# Altium schematic sheet Transmisor2.SchDoc
size A3
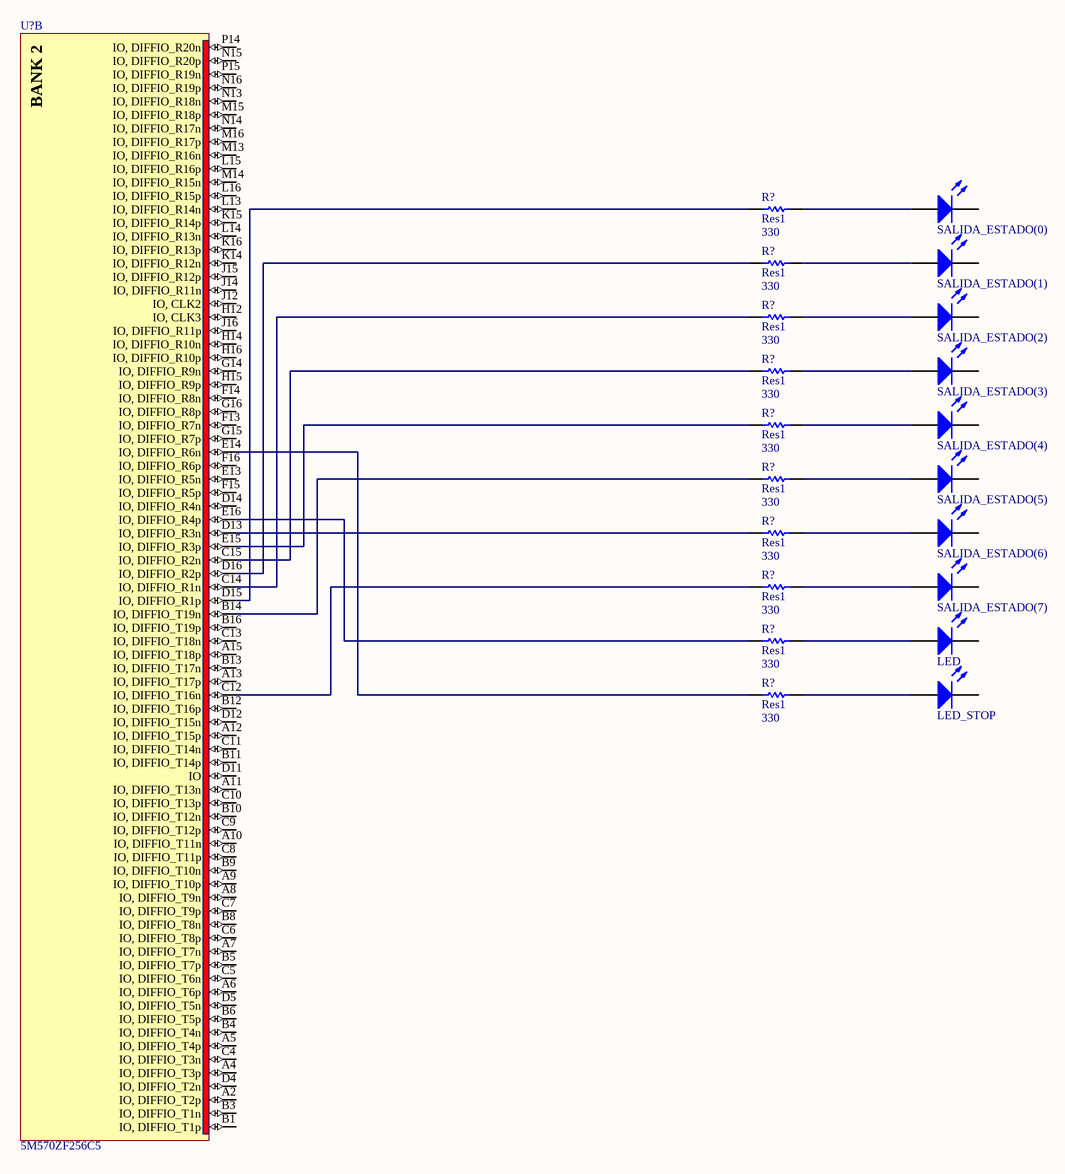
[diagram p0: Transmisor2.SchDoc]

## Parts
(Parts that share a designator on the sheet are numbered #1, #2 ... from top to bottom, then left to right.)
?#1  SALIDA_ESTADO(0)  [LED-0]
?#2  SALIDA_ESTADO(1)  [LED-0]
?#3  SALIDA_ESTADO(2)  [LED-0]
?#4  SALIDA_ESTADO(3)  [LED-0]
?#5  SALIDA_ESTADO(4)  [LED-0]
?#6  SALIDA_ESTADO(5)  [LED-0]
?#7  SALIDA_ESTADO(6)  [LED-0]
?#8  SALIDA_ESTADO(7)  [LED-0]
?#9  LED  [LED-0]
?#10  LED_STOP  [LED-0]
R?#1  Res1  value 330  [AXIAL-0.3]
R?#2  Res1  value 330  [AXIAL-0.3]
R?#3  Res1  value 330  [AXIAL-0.3]
R?#4  Res1  value 330  [AXIAL-0.3]
R?#5  Res1  value 330  [AXIAL-0.3]
R?#6  Res1  value 330  [AXIAL-0.3]
R?#7  Res1  value 330  [AXIAL-0.3]
R?#8  Res1  value 330  [AXIAL-0.3]
R?#9  Res1  value 330  [AXIAL-0.3]
R?#10  Res1  value 330  [AXIAL-0.3]
U?  5M570ZF256C5  [FBGA256_A-155]  (part B of 5)

## Nets
Net?#1_1: ?#1.1(A) R?#1.2
Net?#2_1: ?#2.1(A) R?#2.2
Net?#3_1: ?#3.1(A) R?#3.2
Net?#4_1: ?#4.1(A) R?#4.2
Net?#5_1: ?#5.1(A) R?#5.2
Net?#6_1: ?#6.1(A) R?#6.2
Net?#7_1: ?#7.1(A) R?#7.2
Net?#8_1: ?#8.1(A) R?#8.2
Net?#9_1: ?#9.1(A) R?#9.2
Net?#10_1: ?#10.1(A) R?#10.2
NetR?#1_1: R?#1.1 U?.D15(IO,_DIFFIO_R1p)
NetR?#2_1: R?#2.1 U?.D16(IO,_DIFFIO_R2p)
NetR?#3_1: R?#3.1 U?.C14(IO,_DIFFIO_R1n)
NetR?#4_1: R?#4.1 U?.C15(IO,_DIFFIO_R2n)
NetR?#5_1: R?#5.1 U?.E15(IO,_DIFFIO_R3p)
NetR?#6_1: R?#6.1 U?.B14(IO,_DIFFIO_T19n)
NetR?#7_1: R?#7.1 U?.D13(IO,_DIFFIO_R3n)
NetR?#8_1: R?#8.1 U?.C12(IO,_DIFFIO_T16n)
NetR?#9_1: R?#9.1 U?.E16(IO,_DIFFIO_R4p)
NetR?#10_1: R?#10.1 U?.E14(IO,_DIFFIO_R6n)

Not connected (* = marked no-connect by the designer): ?#1 2(K); ?#2 2(K); ?#3 2(K); ?#4 2(K); ?#5 2(K); ?#6 2(K); ?#7 2(K); ?#8 2(K); ?#9 2(K); ?#10 2(K); U? A2(IO,_DIFFIO_T2p) A4(IO,_DIFFIO_T3p) A5(IO,_DIFFIO_T4p) A6(IO,_DIFFIO_T6p) A7(IO,_DIFFIO_T7n) A8(IO,_DIFFIO_T9n) A9(IO,_DIFFIO_T10p) A10(IO,_DIFFIO_T11n) A11(IO,_DIFFIO_T13n) A12(IO,_DIFFIO_T15p) A13(IO,_DIFFIO_T17p) A15(IO,_DIFFIO_T18p) B1(IO,_DIFFIO_T1p) B3(IO,_DIFFIO_T1n) B4(IO,_DIFFIO_T4n) B5(IO,_DIFFIO_T7p) B6(IO,_DIFFIO_T5p) B8(IO,_DIFFIO_T8n) B9(IO,_DIFFIO_T10n) B10(IO,_DIFFIO_T12n) B11(IO,_DIFFIO_T14p) B12(IO,_DIFFIO_T16p) B13(IO,_DIFFIO_T17n) B16(IO,_DIFFIO_T19p) C4(IO,_DIFFIO_T3n) C5(IO,_DIFFIO_T6n) C6(IO,_DIFFIO_T8p) C7(IO,_DIFFIO_T9p) C8(IO,_DIFFIO_T11p) C9(IO,_DIFFIO_T12p) C10(IO,_DIFFIO_T13p) C11(IO,_DIFFIO_T14n) C13(IO,_DIFFIO_T18n) D4(IO,_DIFFIO_T2n) D5(IO,_DIFFIO_T5n) D11(IO) D12(IO,_DIFFIO_T15n) D14(IO,_DIFFIO_R4n) E13(IO,_DIFFIO_R5n) F13(IO,_DIFFIO_R7n) F14(IO,_DIFFIO_R8n) F15(IO,_DIFFIO_R5p) F16(IO,_DIFFIO_R6p) G14(IO,_DIFFIO_R9n) G15(IO,_DIFFIO_R7p) G16(IO,_DIFFIO_R8p) H12(IO,_CLK3) H14(IO,_DIFFIO_R10n) H15(IO,_DIFFIO_R9p) H16(IO,_DIFFIO_R10p) J12(IO,_CLK2) J14(IO,_DIFFIO_R11n) J15(IO,_DIFFIO_R12p) J16(IO,_DIFFIO_R11p) K14(IO,_DIFFIO_R12n) K15(IO,_DIFFIO_R14p) K16(IO,_DIFFIO_R13p) L13(IO,_DIFFIO_R14n) L14(IO,_DIFFIO_R13n) L15(IO,_DIFFIO_R16p) L16(IO,_DIFFIO_R15p) M13(IO,_DIFFIO_R16n) M14(IO,_DIFFIO_R15n) M15(IO,_DIFFIO_R18p) M16(IO,_DIFFIO_R17p) N13(IO,_DIFFIO_R18n) N14(IO,_DIFFIO_R17n) N15(IO,_DIFFIO_R20p) N16(IO,_DIFFIO_R19p) P14(IO,_DIFFIO_R20n) P15(IO,_DIFFIO_R19n)

## Notes on the sheet
- (in symbol 5M570ZF256C5, part B) BANK 2

## Library data of the parts
?#1-?#10 = LED0: Typical INFRARED GaAs LED; Published: 8-Jun-2000; LatestRevisionDate: 08-Jul-2005; LatestRevisionNote: Mech Layer 1 removed.; PackageReference: LED-0; Publisher: Altium Limited; PackageDescription: LED; 2 Leads
R?#1-R?#10 = Res1: Resistor; Published: 8-Jun-2000; LatestRevisionDate: 17-Jul-2002; LatestRevisionNote: Re-released for DXP Platform.; PackageReference: AXIAL-0.3; Publisher: Altium Limited; PackageDescription: Axial Device, Thru-Hole; 2 Leads; 0.3 in Pin Spacing
U? = 5M570ZF256C5: MAX V 1.8V CPLD, 159 IOs, 570 Logic Elements, 256-Pin FBGA, Commercial Temperature, Speed Grade 5; DatasheetVersion: ver1.2, May-2011; PackageVersion: ver2.0, Nov-2011; PackageReference: FBGA256_A-155; PackageDescription: 256-Pin FineLine Ball-Grid Array (FBGA) - Thin - Wire Bond - A:1.55; Code_JEDEC: MO-192-DAF-1; ComponentLink1Description: Manufacturer URL; ComponentLink1URL: http://www.altera.com/; ComponentLink2Description: Datasheet; ComponentLink2URL: http://www.altera.com/literature/hb/max-v/max5_handbook.pdf; ComponentLink3Description: MAX V Device Pin-Out files; ComponentLink3URL: http://www.altera.com/literature/lit-dp.jsp?category=MAX%205&showspreadsheet=y; ComponentLink4Description: Package Specification; ComponentLink4URL: http://www.altera.com/devicepackaging/04R-00230_03.pdf